# Altium schematic sheet Main.SchDoc: MAIN
size A4; Author: Davide Bortolami; DocumentNumber: 1; SheetNumber: 1; SheetTotal: 2
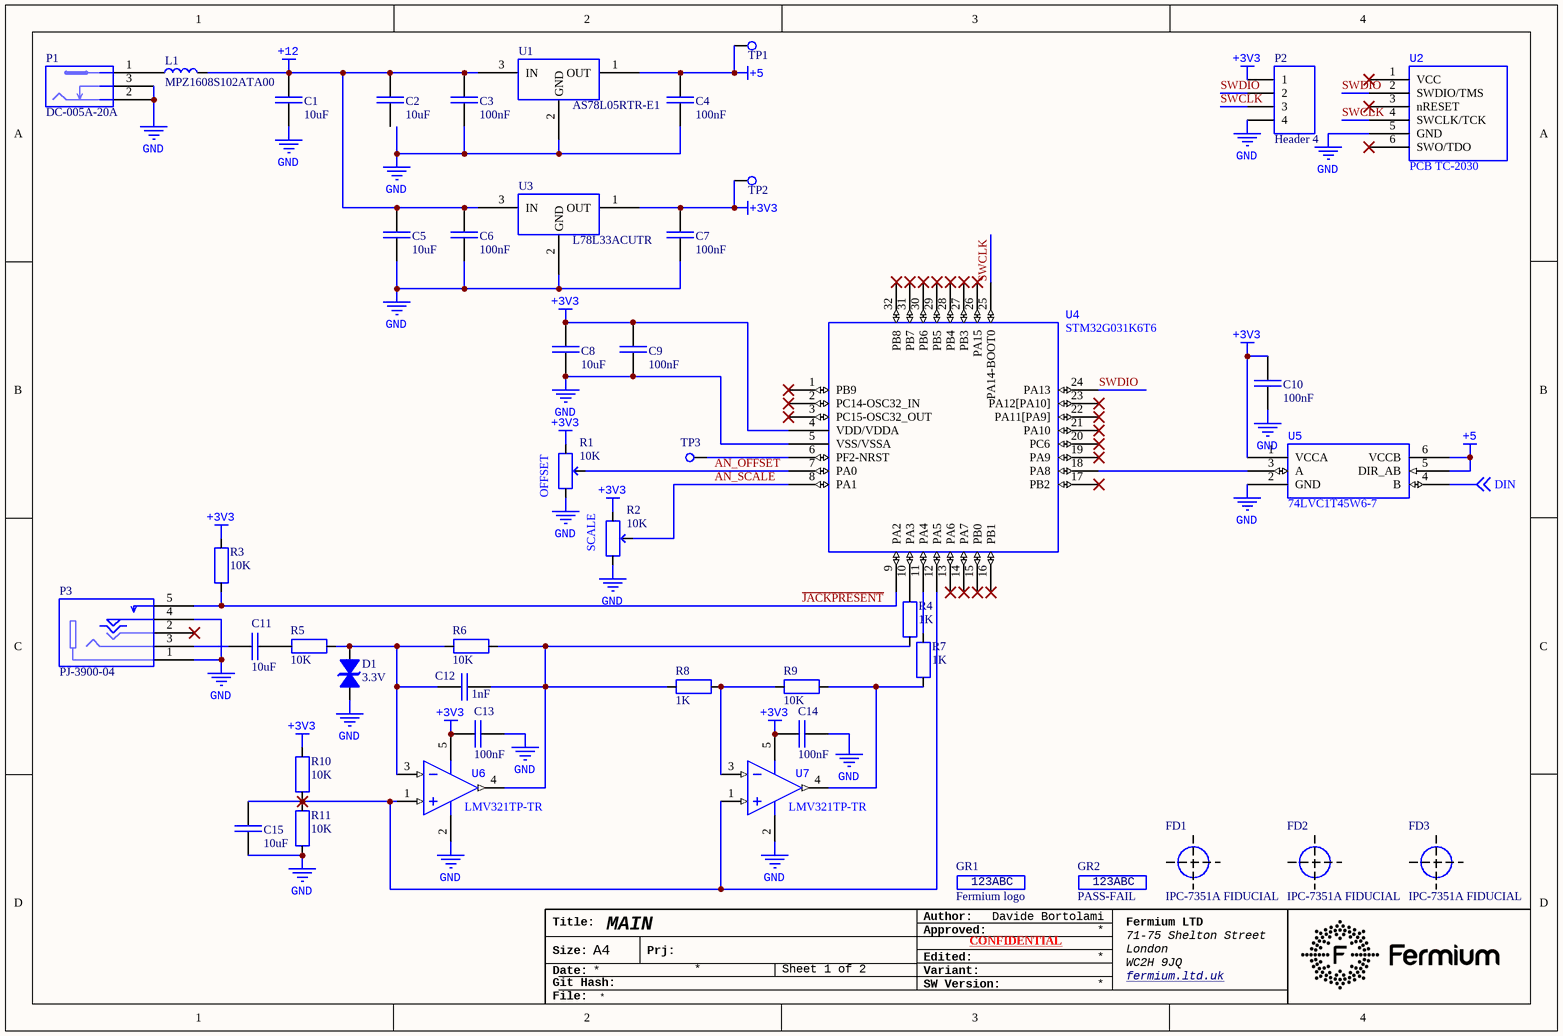
[diagram p0: Main.SchDoc]

## Parts
C1  10uF  [CAP 0805_2012]
C2  10uF  [CAP 0805_2012]
C3  100nF  [CAP 0603_1608]
C4  100nF  [CAP 0603_1608]
C5  10uF  [CAP 0805_2012]
C6  100nF  [CAP 0603_1608]
C7  100nF  [CAP 0603_1608]
C8  10uF  [CAP 0805_2012]
C9  100nF  [CAP 0603_1608]
C10  100nF  [CAP 0603_1608]
C11  10uF  [CAP 0805_2012]
C12  1nF  [CAP 0603_1608]
C13  100nF  [CAP 0603_1608]
C14  100nF  [CAP 0603_1608]
C15  10uF  [CAP 0805_2012]
D1  3.3V  [SOD523F]
FD1  IPC-7351A FIDUCIAL  [FIDUCIAL-IPC-7351A]  (no BOM)
FD2  IPC-7351A FIDUCIAL  [FIDUCIAL-IPC-7351A]  (no BOM)
FD3  IPC-7351A FIDUCIAL  [FIDUCIAL-IPC-7351A]  (no BOM)
GR1  Fermium logo  [FERMIUM_LTD_LOGO_SILKSCREEN_10]  (no BOM)
GR2  PASS-FAIL  [0B1556B7-A534-4801-B57D-01EFA34B1205]  (no BOM)
L1  MPZ1608S102ATA00  [FER 0603_1608]
P1  DC-005A-20A  [F0972D8A-C5C0-4A84-836D-A9666EE65C2D]
P2  Header 4  [e9c29c42-54d9-41fd-bacf-81f9be1beea3]
P3  PJ-3900-04  [7EF2B92C-0FC9-4C85-B662-5CEC65BFCCC4]
R1  10K  [62a97406-280f-49a8-9d3d-28b5dbb37269]
R2  10K  [62a97406-280f-49a8-9d3d-28b5dbb37269]
R3  10K  [RES 0603_1608]
R4  1K  [RES 0603_1608]
R5  10K  [RES 0603_1608]
R6  10K  [RES 0603_1608]
R7  1K  [RES 0603_1608]
R8  1K  [RES 0603_1608]
R9  10K  [RES 0603_1608]
R10  10K  [RES 0603_1608]
R11  10K  [RES 0603_1608]
TP1  GENERIC_TP  [TESTPOINT_PAD_1]  (value not drawn)  (no BOM)
TP2  GENERIC_TP  [TESTPOINT_PAD_1]  (value not drawn)  (no BOM)
TP3  GENERIC_TP  [TESTPOINT_PAD_1]  (value not drawn)  (no BOM)
U1  AS78L05RTR-E1  [E733EFB9-FE91-4AE9-9197-29251971C3DC]
U2  PCB TC-2030  [2B810B8A-BCA2-4013-BFB9-397E8F2967E9]  (no BOM)
U3  L78L33ACUTR  [E733EFB9-FE91-4AE9-9197-29251971C3DC]
U4  STM32G031K6T6  [ST LQFP-32 7X7MM]
U5  74LVC1T45W6-7  [cf179999-1370-4c97-8dae-266d481a25b7]
U6  LMV321TP-TR  [TI SOT-23-5 DBV]
U7  LMV321TP-TR  [TI SOT-23-5 DBV]

## Nets
+3V3: C7.2 C8.1 C9.2 C10.2 C13.2 C14.2 P2.1 R1.1 R2.1 R3.2 R10.2 TP2.1(TP) U3.1(OUT) U4.4(VDD/VDDA) U5.1(VCCA) U6.5(+V) U7.5(+V)
+5: C4.2 TP1.1(TP) U1.1(OUT) U5.5(DIR_AB) U5.6(VCCB)
+12: C1.1 C2.1 C3.2 C5.1 C6.2 L1.2 U1.3(IN) U3.3(IN)
GND: C1.2 C3.1 C4.1 C5.2 C6.1 C7.1 C8.2 C9.1 C10.1 C13.1 C14.1 C15.2 D1.2 P1.2 P1.3 P2.4 P3.1(GND) P3.4(AUX) R1.3 R2.3 R11.1 U1.2(GND) U2.5(GND) U3.2(GND) U4.5(VSS/VSSA) U5.2(GND) U6.2(-V) U7.2(-V)
~{JACKPRESENT}: P3.5(AUX) R3.1 U4.9(PA2)
AN_OFFSET: R1.2 U4.7(PA0)
AN_SCALE: R2.2 U4.8(PA1)
DIN: U5.4(B) ; off-sheet DIN
SWCLK: P2.3 U2.4(SWCLK/TCK) U4.25(PA14-BOOT0)
SWDIO: P2.2 U2.2(SWDIO/TMS) U4.24(PA13)
NetC11_1: C11.1 R5.2
NetC11_2: C11.2 P3.3(L)
NetC12_1: C12.1 D1.1 R5.1 R6.2 U6.3(-IN)
NetC12_2: C12.2 R4.2 R6.1 R8.1 U6.4(OUT)
NetC15_1: C15.1 R10.1 R11.2 U4.12(PA5) U6.1(+IN) U7.1(+IN)
NetL1_1: L1.1 P1.1
NetR4_1: R4.1 U4.10(PA3)
NetR7_1: R7.1 U4.11(PA4)
NetR7_2: R7.2 R9.1 U7.4(OUT)
NetR8_2: R8.2 R9.2 U7.3(-IN)
NetTP3_1: TP3.1(TP) U4.6(PF2-NRST)
NetU4_18: U4.18(PA8) U5.3(A)

Not connected (* = marked no-connect by the designer): C2 2; P3 2(R)*; U2 1(VCC)* 3(nRESET)* 6(SWO/TDO)*; U4 1(PB9)* 2(PC14-OSC32_IN)* 3(PC15-OSC32_OUT)* 13(PA6)* 14(PA7)* 15(PB0)* 16(PB1)* 17(PB2)* 19(PA9)* 20(PC6)* 21(PA10)* 22(PA11[PA9])* 23(PA12[PA10])* 26(PA15)* 27(PB3)* 28(PB4)* 29(PB5)* 30(PB6)* 31(PB7)* 32(PB8)*

## Notes on the sheet
- (near R1) OFFSET
- (near R2) SCALE
- Title:
- Author:
- Approved:
- Fermium LTD
- Size:
- Date:
- Git Hash:
- A4
- Prj:
- SW Version:
- Variant:
- Edited:
- CONFIDENTIAL
- 71-75 Shelton Street
- London
- WC2H 9JQ
- fermium.ltd.uk <http://fermium.ltd.uk>
- File:
- (in symbol 9b9b4e4a-5411-4d6f-b18b-a922f0d19254) 123ABC
- (in symbol d1abe19f-3fed-4f20-b2ed-afc0ffbc6628) 123ABC

## Library data of the parts
C1 C2 C5 C8 C11 C15 = 1ffbe5a9-0884-4740-bdad-20a6a98400e6: CAP SMD MLCC 10uF 25V 0805 X5R; Manufacturer 1: Samsung Electro-Mechanics; Manufacturer Part Number 1: CL21A106KAYNNNE; id: 14779; S 1: LCSC; SPN 1: C15850; SPN 2: C84416; Part Number: 1ffbe5a9-0884-4740-bdad-20a6a98400e6; ComponentLink1Description: Datasheet; ComponentLink1URL: http://localhost:8080/static/files/Samsung-Electro-Mechanics-CL21A106KAYNNNE_C158502019-03-10_213827.610739.pdf?Samsung-Electro-Mechanics-CL21A106KAYNNNE_C15850.pdf; Manufacturer 2: Murata; Manufacturer Part Number 2: GRM21BR61E106KA73L; S 2: LCSC; Value: 10uF
C3 C4 C6 C7 C9 C10 C13 C14 = 02841f84-ac15-41b5-9e17-915f8f067828: CAP SMD MLCC 100nF 25V 0603 X7R; Manufacturer 1: Samsung Electro-Mechanics; Manufacturer Part Number 1: CL10B104KA8NNNC; id: 14784; S 1: LCSC; SPN 1: C14663; SPN 2: C1590; Part Number: 02841f84-ac15-41b5-9e17-915f8f067828; ComponentLink1Description: Datasheet; ComponentLink1URL: http://localhost:8080/static/files/Samsung-Electro-Mechanics-CL10B104KA8NNNC_C15902019-03-10_215548.826887.pdf?Samsung-Electro-Mechanics-CL10B104KA8NNNC_C1590.pdf; Manufacturer 2: Yageo; Manufacturer Part Number 2: CC0603KRX7R9BB104; S 2: LCSC; Value: 100nF
C12 = 0eca2548-3630-4fea-a3d5-94248c1cae74: CAP SMD MLCC 1nF 50V 0603 X7R; Manufacturer 1: Samsung Electro-Mechanics; Manufacturer Part Number 1: CL10B102KB8NNNC; id: 14785; S 1: LCSC; SPN 1: C1588; Part Number: 0eca2548-3630-4fea-a3d5-94248c1cae74; ComponentLink1Description: Datasheet; ComponentLink1URL: http://localhost:8080/static/files/Samsung-Electro-Mechanics-CL10B102KB8NNNC_C1588_12019-03-10_215732.131818.pdf?Samsung-Electro-Mechanics-CL10B102KB8NNNC_C1588 (1).pdf; Value: 1nF
D1 = d6266fd0-7428-4fb9-a062-338cdce926fd: DIODE SMD TVS 3.3V BIDIRECTIONAL SOD-523; Manufacturer 1: Born Semiconductor; Manufacturer Part Number 1: PESD3V3S1BA-N; id: 14798; S 1: LCSC; SPN 1: C316037; SPN 2: C85377; Part Number: d6266fd0-7428-4fb9-a062-338cdce926fd; ComponentLink1Description: Datasheet; ComponentLink1URL: http://localhost:8080/static/files/Bourne-Semicon-Shenzhen-PESD3V3S1BA-N_C3160372019-04-07_002431.794112.pdf?Bourne-Semicon-Shenzhen-PESD3V3S1BA-N_C316037.pdf; ComponentLink2Description: Datasheet; ComponentLink2URL: http://localhost:8080/static/files/Nexperia-PESD3V3S1UB115-datasheet2019-08-16_201415.198759.pdf?Nexperia-PESD3V3S1UB,115-datasheet.pdf; Manufacturer 2: Nexperia; Manufacturer Part Number 2: PESD3V3S1UB,115; S 2: LCSC; Value: 3.3V
FD1-FD3 = 19da4612-eb95-43bb-9984-553a52b2a224: GRAPHICS FIDUCIAL IPC-7351A; id: 14800; Part Number: 19da4612-eb95-43bb-9984-553a52b2a224
GR1 = 9b9b4e4a-5411-4d6f-b18b-a922f0d19254: GRAPHICS LOGO FERMIUM LTD; id: 14856; Part Number: 9b9b4e4a-5411-4d6f-b18b-a922f0d19254
GR2 = d1abe19f-3fed-4f20-b2ed-afc0ffbc6628: GRAPHICS PASS-FAIL MARK; id: 14801; Part Number: d1abe19f-3fed-4f20-b2ed-afc0ffbc6628
L1 = a4b2e015-bf25-47b8-954c-a5b040744a3a: FER SMD CHIP 0603 800mA 1K@100MHz 300mOhm; Manufacturer 1: TDK; id: 14850; S 1: LCSC; SPN 1: C76814; Part Number: a4b2e015-bf25-47b8-954c-a5b040744a3a; ComponentLink1Description: Datasheet; ComponentLink1URL: http://localhost:8080/static/files/TDK-MPZ1608S102ATA00_C768142019-08-18_021255.210641.pdf?TDK-MPZ1608S102ATA00_C76814.pdf; Manufacturer Part Number 1: MPZ1608S102ATA00
P1 = b53db51a-1725-412b-9039-fa7a45c7c438: CONN THT DC JACK 0.5A 30VDC 5Kcycles; Manufacturer 1: HRO Electronics; id: 14780; S 1: LCSC; SPN 1: C191049; Part Number: b53db51a-1725-412b-9039-fa7a45c7c438; ComponentLink1Description: Datasheet; ComponentLink1URL: http://localhost:8080/static/files/Korean-Hroparts-Elec-DC-005A-20A_C191049_22019-03-10_214231.486078.pdf?Korean-Hroparts-Elec-DC-005A-20A_C191049 (2).pdf; Manufacturer Part Number 1: DC-005A-20A
P2 = f5b883e6-c938-48c0-af3c-bf25c091d7e5: CONN THT PIN HEADER 4P MALE 2.54mm; Manufacturer 1: Pinrex; Manufacturer Part Number 1: 210-91-04GB01; id: 14864; S 1: LCSC; SPN 1: C390680; SPN 2: C358686; Part Number: f5b883e6-c938-48c0-af3c-bf25c091d7e5; ComponentLink1Description: Datasheet; ComponentLink1URL: http://localhost:8080/static/files/1912111437_PINREX-210-91-04GB01_C3906802020-10-20_152510.967226.pdf?1912111437_PINREX-210-91-04GB01_C390680.pdf; ComponentLink2Description: Datasheet; ComponentLink2URL: http://localhost:8080/static/files/1901241805_MINTRON-MTP125-1104S1_C3586862020-10-20_152535.142763.pdf?1901241805_MINTRON-MTP125-1104S1_C358686.pdf; Manufacturer 2: Mintron; Manufacturer Part Number 2: MTP125-1104S1; S 2: LCSC
P3 = 80507a24-5d7c-4cf5-953e-f54832d54564: CONN THT 3.5mm AUDIO STEREO AUX SWITCH; Manufacturer 1: HRO Electronics; id: 14793; S 1: LCSC; SPN 1: C151839; Part Number: 80507a24-5d7c-4cf5-953e-f54832d54564; ComponentLink1Description: Datasheet; ComponentLink1URL: http://localhost:8080/static/files/Korean-Hroparts-Elec-PJ-3900-04_C1518392019-04-10_231144.687617.pdf?Korean-Hroparts-Elec-PJ-3900-04_C151839.pdf; Manufacturer Part Number 1: PJ-3900-04
R1 R2 = 811e8213-c804-44c4-a27d-e9429bf8a5f3: POT 10K 20% SHAFT 6mmx20mm LIN; Manufacturer 1: ALPS; Manufacturer Part Number 1: RK09K1130AAU; id: 14863; S 1: LCSC; SPN 1: C202373; Part Number: 811e8213-c804-44c4-a27d-e9429bf8a5f3; ComponentLink1Description: Datasheet; ComponentLink1URL: http://localhost:8080/static/files/ALPS-Electric-RK09K1130AAU_C2023732020-10-20_140659.863467.pdf?ALPS-Electric-RK09K1130AAU_C202373.pdf; Value: 10K
R3 R5 R6 R9-R11 = 93242766-ba1d-462d-b58f-ce1dfc4129c8: RES SMD 10K OHM 1% 1/10W 0603; Manufacturer 1: Yageo; Manufacturer Part Number 1: RC0603FR-0710KL; id: 12101; S 1: LCSC; SPN 1: C98220; SPN 2: C25804; Part Number: 93242766-ba1d-462d-b58f-ce1dfc4129c8; Manufacturer 2: Uniroyal; Manufacturer Part Number 2: 0603WAF1002T5E; S 2: LCSC; Value: 10K
R4 R7 R8 = a678220f-9e9d-4863-a833-9993504f723c: RES SMD 1K OHM 1% 1/10W 0603; Manufacturer 1: Yageo; Manufacturer Part Number 1: RC0603FR-071KL; id: 14794; S 1: LCSC; SPN 1: C21190; SPN 2: C22548; Part Number: a678220f-9e9d-4863-a833-9993504f723c; Manufacturer 2: Uniroyal; Manufacturer Part Number 2: 0603WAF1001T5E; S 2: LCSC; Value: 1K
TP1-TP3 = f8b69d87-0719-4ff6-a360-6747ce659b9b: GRAPHICS TESTPOINT; id: 14821; Part Number: f8b69d87-0719-4ff6-a360-6747ce659b9b
U1 = fd64863e-487f-4688-b264-696c0ba5456b: IC SMD LINEAR VOLTAGE REGULATOR 5V 100mA SOT-89; Manufacturer 1: Diodes Inc.; id: 14783; S 1: LCSC; SPN 1: C90763; SPN 2: C90471; Part Number: fd64863e-487f-4688-b264-696c0ba5456b; ComponentLink1Description: Datasheet; ComponentLink1URL: http://localhost:8080/static/files/Diodes-Incorporated-AS78L05RTR-E1_C90471_12019-03-10_215252.941962.pdf?Diodes-Incorporated-AS78L05RTR-E1_C90471 (1).pdf; ComponentLink2Description: Datasheet; ComponentLink2URL: http://localhost:8080/static/files/KIA-Semicon-Tech-KIA78L05T_C90763_12019-03-10_215415.523371.pdf?KIA-Semicon-Tech-KIA78L05T_C90763 (1).pdf; Manufacturer 2: KIA Semicon Tech; Manufacturer Part Number 1: AS78L05RTR-E1; Manufacturer Part Number 2: KIA78L05T; S 2: LCSC
U2 = cfe3e949-5a4b-49e1-a947-d770435823fb: CONN PCB TC-2030 6-PIN ICT/JTAG/SWD; Manufacturer 1: ---; id: 14818; Part Number: cfe3e949-5a4b-49e1-a947-d770435823fb; ComponentLink1Description: Datasheet; ComponentLink1URL: http://localhost:8080/static/files/TC2030-IDC-NL2019-05-03_011703.589349.pdf?TC2030-IDC-NL.pdf; Manufacturer Part Number 1: ---
U3 = 8cc975d7-ef9f-4621-a9d5-14e4ba8cc85a: IC SMD LINEAR VOLTAGE REGULATOR 3.3V 100mA SOT-89; Manufacturer 1: ST Microelectronics; id: 14809; S 1: LCSC; SPN 1: C108493; SPN 2: C14170; Part Number: 8cc975d7-ef9f-4621-a9d5-14e4ba8cc85a; ComponentLink1Description: Datasheet; ComponentLink1URL: http://localhost:8080/static/files/STMicroelectronics-L78L33ACUTR_C141702019-04-29_215238.249911.pdf?STMicroelectronics-L78L33ACUTR_C14170.pdf; Manufacturer 2: Diodes Inc.; Manufacturer Part Number 1: L78L33ACUTR; Manufacturer Part Number 2: AZ1117R-3.3TRE1; S 2: LCSC
U4 = c3cf4caa-a330-4265-b0bb-b1c1ee69c9b2: IC SMD MICROCONTROLLER STM32GO LQFP32; Manufacturer 1: ST Microelectronics; id: 14866; S 1: LCSC; SPN 1: C432202; Part Number: c3cf4caa-a330-4265-b0bb-b1c1ee69c9b2; Manufacturer Part Number 1: STM32G031K6T6
U5 = a4959cd6-b905-4367-9309-5fa19daca31f: IC SMD VOLTAGE LEVEL SHIFTER 1.65-5.5V 74LVC1T45 SOT-23-6; Manufacturer 1: Diodes Inc.; id: 14865; S 1: LCSC; SPN 1: C168856; Part Number: a4959cd6-b905-4367-9309-5fa19daca31f; ComponentLink1Description: Datasheet; ComponentLink1URL: http://localhost:8080/static/files/Diodes_Inc.-74LVC1T45W6-7-datasheet2020-10-20_211713.523042.pdf?Diodes_Inc.-74LVC1T45W6-7-datasheet.pdf; Manufacturer Part Number 1: 74LVC1T45W6-7
U6 U7 = 1bb11b1d-9594-42ee-994b-3a976eac3d2a: IC SMD OPAMP 1X 3.5mV RRIO 6V 45mA [ANY C LOAD STABLE] LMV31TP SOT-23-5; Manufacturer 1: 3Peak; id: 14862; S 1: LCSC; SPN 1: C90297; Part Number: 1bb11b1d-9594-42ee-994b-3a976eac3d2a; ComponentLink1Description: Datasheet; ComponentLink1URL: http://localhost:8080/static/files/LMV321TP-LMV358TP-LMV324TP2020-10-20_131739.786170.pdf?LMV321TP-LMV358TP-LMV324TP.pdf; Manufacturer Part Number 1: LMV321TP-TR